# Altium schematic sheet Interace_PT100.SchDoc
size A2; SPICEModelCacheGZELQBNJ: <root> / <DocumentId>GZELQBNJ</DocumentId> / <CacheFrame Number="0"> / <Model Name="npn" Kind="MDL"> / <Text>*Default NPN BJT / *NPN Trans Pinout: C,B,E / .MODEL NPN NPN()</Text> / </Model> / </CacheFrame> / </root>
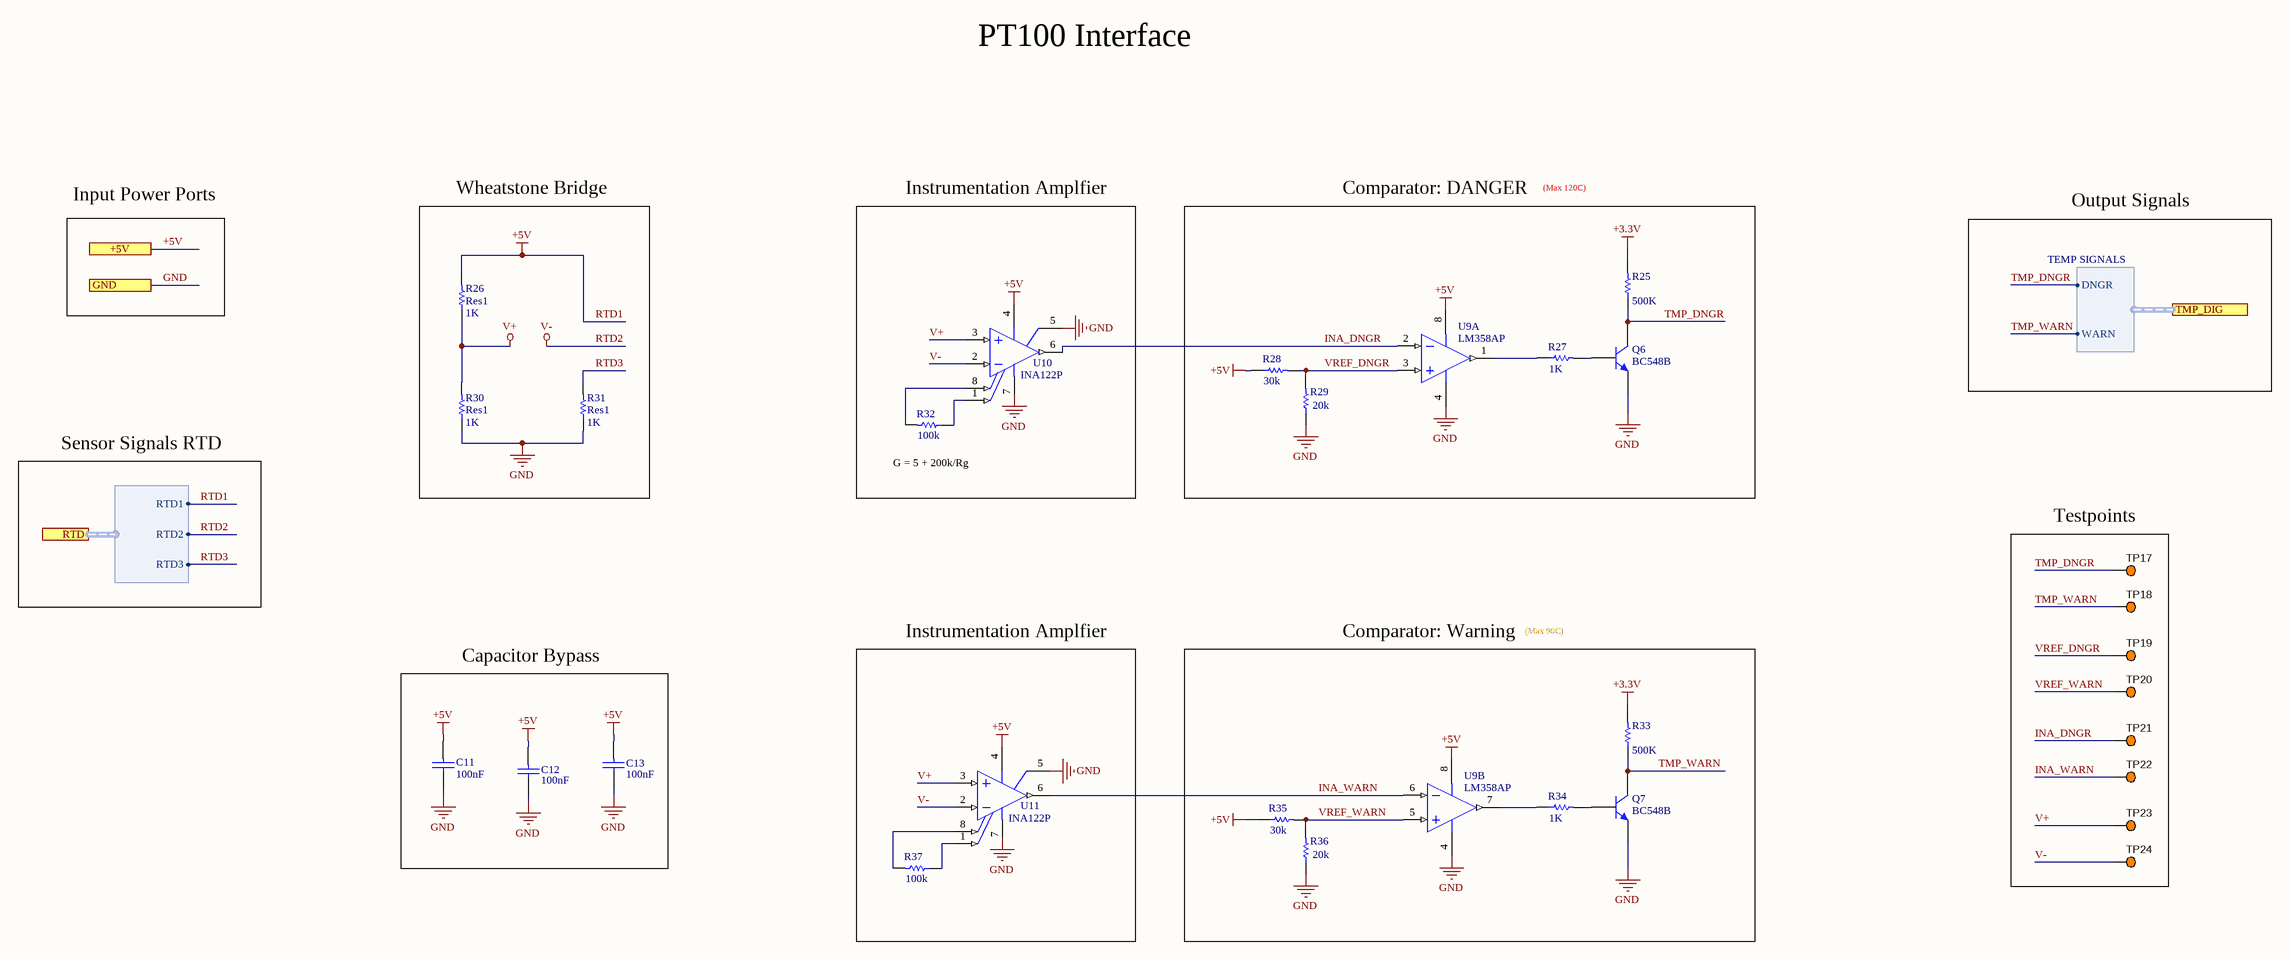
[diagram p0: Interace_PT100.SchDoc]

## Parts
C11  100nF  [CAP200]
C12  100nF  [CAP200]
C13  100nF  [CAP200]
Q6  BC548B  [TO-226-AA]
Q7  BC548B  [TO-226-AA]
R25  value 500K  [AXIAL-0.3]  (hidden comment: Res1)
R26  Res1  value 1K  [AXIAL-0.3]
R27  value 1K  [AXIAL-0.3]  (hidden comment: Res1)
R28  value 30k  [AXIAL-0.3]  (hidden comment: Res1)
R29  value 20k  [AXIAL-0.3]  (hidden comment: Res1)
R30  Res1  value 1K  [AXIAL-0.3]
R31  Res1  value 1K  [AXIAL-0.3]
R32  value 100k  [AXIAL-0.3]  (hidden comment: Res1)
R33  value 500K  [AXIAL-0.3]  (hidden comment: Res1)
R34  value 1K  [AXIAL-0.3]  (hidden comment: Res1)
R35  value 30k  [AXIAL-0.3]  (hidden comment: Res1)
R36  value 20k  [AXIAL-0.3]  (hidden comment: Res1)
R37  value 100k  [AXIAL-0.3]  (hidden comment: Res1)
TP17  5003  [KSTN-5003]  (value not drawn)
TP18  5003  [KSTN-5003]  (value not drawn)
TP19  5003  [KSTN-5003]  (value not drawn)
TP20  5003  [KSTN-5003]  (value not drawn)
TP21  5003  [KSTN-5003]  (value not drawn)
TP22  5003  [KSTN-5003]  (value not drawn)
TP23  5003  [KSTN-5003]  (value not drawn)
TP24  5003  [KSTN-5003]  (value not drawn)
U9  LM358AP  [P0008A]  (parts A,B of 2)
U10  INA122P  [P0008A]
U11  INA122P  [P0008A]

## Blocks framed on the sheet
Wheatstone Bridge: R26 R30 R31
Instrumentation Amplfier: R32 U10
Comparator: DANGER: Q6 R25 R27-R29 U9
Testpoints: TP17-TP24
Capacitor Bypass: C11-C13
Instrumentation Amplfier: R37 U11
Comparator: Warning: Q7 R33-R36 U9

## Ports
+5V, GND, RTD (harness RTD), TMP_DIG (harness TEMP SIGNALS)

## Harnesses
?: RTD1, RTD2, RTD3
TEMP SIGNALS: WARN, DNGR

## Nets
+3.3V: R25.2 R33.2
+5V: C11.1 C12.1 C13.1 R26.2 R28.1 R35.1 U9.8(VCC) U10.4(V-) U11.4(V-) ; port +5V, port RTD.RTD1  [also labelled RTD1]
GND: C11.2 C12.2 C13.2 Q6.3(E) Q7.3(E) R29.1 R30.1 R31.1 R36.1 U9.4(GND) U10.5(REF) U11.5(REF) ; port GND
RTD2: TP24.1 U10.2(VIN-) U11.2(VIN-) ; port RTD.RTD2  [also labelled V-]
V+: R26.1 R30.2 TP23.1 U10.3(VIN+) U11.3(VIN+)
INA_DNGR: TP21.1 U9.2(1IN-) U10.6(VO)
INA_WARN: TP22.1 U9.6(2IN-) U11.6(VO)
RTD3: R31.2 ; port RTD.RTD3
TMP_DNGR: Q6.1(C) R25.1 TP17.1 ; port TMP_DIG.DNGR
TMP_WARN: Q7.1(C) R33.1 TP18.1 ; port TMP_DIG.WARN
VREF_DNGR: R28.2 R29.2 TP19.1 U9.3(1IN+)
VREF_WARN: R35.2 R36.2 TP20.1 U9.5(2IN+)
NetQ6_2: Q6.2(B) R27.2
NetQ7_2: Q7.2(B) R34.2
NetR27_1: R27.1 U9.1(1OUT)
NetR32_1: R32.1 U10.1(RG)
NetR32_2: R32.2 U10.8(RG)
NetR34_1: R34.1 U9.7(2OUT)
NetR37_1: R37.1 U11.1(RG)
NetR37_2: R37.2 U11.8(RG)

Not connected (* = marked no-connect by the designer): U10 7(V+); U11 7(V+)

## Notes on the sheet
- PT100 Interface
- Input Power Ports
- (Max 120C)
- Output Signals
- Sensor Signals RTD
- (near R32) G = 5 + 200k/Rg
- (Max 90C)
- Labels drawn without touching a wire or pin: GND

## Library data of the parts
C11-C13 = CAP
Q6 Q7 = NPN: NPN Bipolar Transistor; Published: 8-Jun-2000; LatestRevisionDate: 17-Jul-2002; LatestRevisionNote: Re-released for DXP Platform.; PackageReference: TO-226-AA; Publisher: Altium Limited; PackageDescription: TO, Flat Index; 3 In-Line, Axial Leads; Body Dia. 4.8mm; Leads 0.55 x 0.51 mm (max); Code_JEDEC: TO-226-AA
R25-R37 = Res1: Resistor; Published: 8-Jun-2000; LatestRevisionDate: 17-Jul-2002; LatestRevisionNote: Re-released for DXP Platform.; PackageReference: AXIAL-0.3; Publisher: Altium Limited; PackageDescription: Axial Device, Thru-Hole; 2 Leads; 0.3 in Pin Spacing
TP17-TP24 = CMP-002-00037-2: Test Point, Orange, Height 4.6 mm, Tail Length 3 mm, 1-Pin THD, RoHS; Manufacturer: Keystone; Colour: Orange; Packaging: Bulk; Package Description: 1-Pin Through Hole Device, Dia 2.54 mm; Pins: 1; Package Reference: 5003; Datasheet Version: Jun-15; Case/Package: 5003; Mounting Technology: TH; Connector Type: TestPoint; Diameter: 2.54mm; Contact Material: Bronze; Datasheet URL: http://keyelco.com/userAssets/file/M65p56.pdf; Manufacturer URL: http://www.keyelco.com/; Package Quantity: 10; Contact Plating: Tin; RoHS Compliant: True
U9 = CMP-014-00023-2: Dual Operational Amplifier, 3 to 32 V, 0 to 70 degC, 8-Pin PDIP (P), Pb-Free (RoHS), Tube; Manufacturer: Texas Instruments (TI); Channels: 2; Max Dual Supply Voltage: 16V; Min Dual Supply Voltage: 1.5V; Slew Rate: 0.3V/us; Unity Gain Bandwidth Product: 700KHz; Common Mode Rejection Ratio: 65dB; Nominal Supply Voltage: 5V; Package Version: 4040082/E, 04/2010; Output Current: 30mA; Nominal Supply Current: 1.2mA; Nominal Voltage Gain: 100dB; Case/Package: DIP; Max Operating Temperature: 70°C; RoHS Compliant: True; Manufacturer URL: http://www.ti.com/; Pins: 8; Package Description: 8-Pin Double In-line Package, Body 9.59 x 6.35 mm, Pitch 2.54 mm; Datasheet URL: http://www.ti.com/lit/ds/symlink/lm358a.pdf; Max Supply Voltage: 16V; Package Reference: P0008A; Mounting Technology: TH; Min Operating Temperature: 0°C; Package URL: http://www.ti.com/lit/ml/mpdi001b/mpdi001b.pdf; Min Supply Voltage: 1.5V; Package Quantity: 50; Packaging: Rail/Tube; Datasheet Version: SLOS068T, 04/2015; Nominal Gain Bandwith Product: 700KHz
U10 U11 = CMP-014-00006-1: Instrumentation Amplifier, 1 Func, 250uV Offset-Max, 0.12MHz Band Width, PDIP8; Qualification Status: Not Qualified; Bandwidth (3dB)-Nom: 120kHz; Max Supply Current: 85uA; Supply Voltage Limit-Max: 18V; Voltage Gain-Max: 10000; Surface Mount: No; Slew Rate: 0.08V/µs; Non-linearity-Max: 0.012%; Package Body Material: Plastic; Voltage Gain-Min: 5; Input Offset Current-Max (IIO): 2nA; Neg Supply Voltage Limit-Max: -18V; Channels: 1; Common Mode Rejection Ratio-Min: 83dB; Power Supplies: 2.2/36/+-18V; Nominal Supply Voltage: 15V; Average Bias Current-Max (IIB): -25nA; Voltage Gain-Nom: 100; Package Equivalence Code: DIP8,.3; Pins: 8; Min Operating Temperature: -40°C; Terminal Position: DUAL; JESD-30 Code: R-PDIP-T8; Reach SVHC Compliant: Yes; Max Operating Temperature: 85°C; Case/Package: DIP; Package Style: IN-LINEMeter; RoHS Compliant: Yes; Terminal Pitch: 2.54mm; Height - Seated (Max): 5.08mm; Length: 9.81mm; JESD-609 Code: e4; Terminal Form: Through Hole; Terminal Finish: Nickel; Amplifier Type: INSTRUMENTATION AMPLIFIER; Package Shape: Rectangular; Width: 7.62mm; Temperature Grade: INDUSTRIAL; Input Offset Voltage-Max: 250uV